# EasyEDA Pro project Flight_Control_V3.eprj

# Schematic Schematic1
Board Name: Board1; Create Date: 2026-01-02; Page Name: P1; Project Name: Flight_Control_V2; Schematic Name: Schematic1; Update Date: 2026-01-20; Company: 嘉立创EDA; Page Size: A4; Version: V1.0
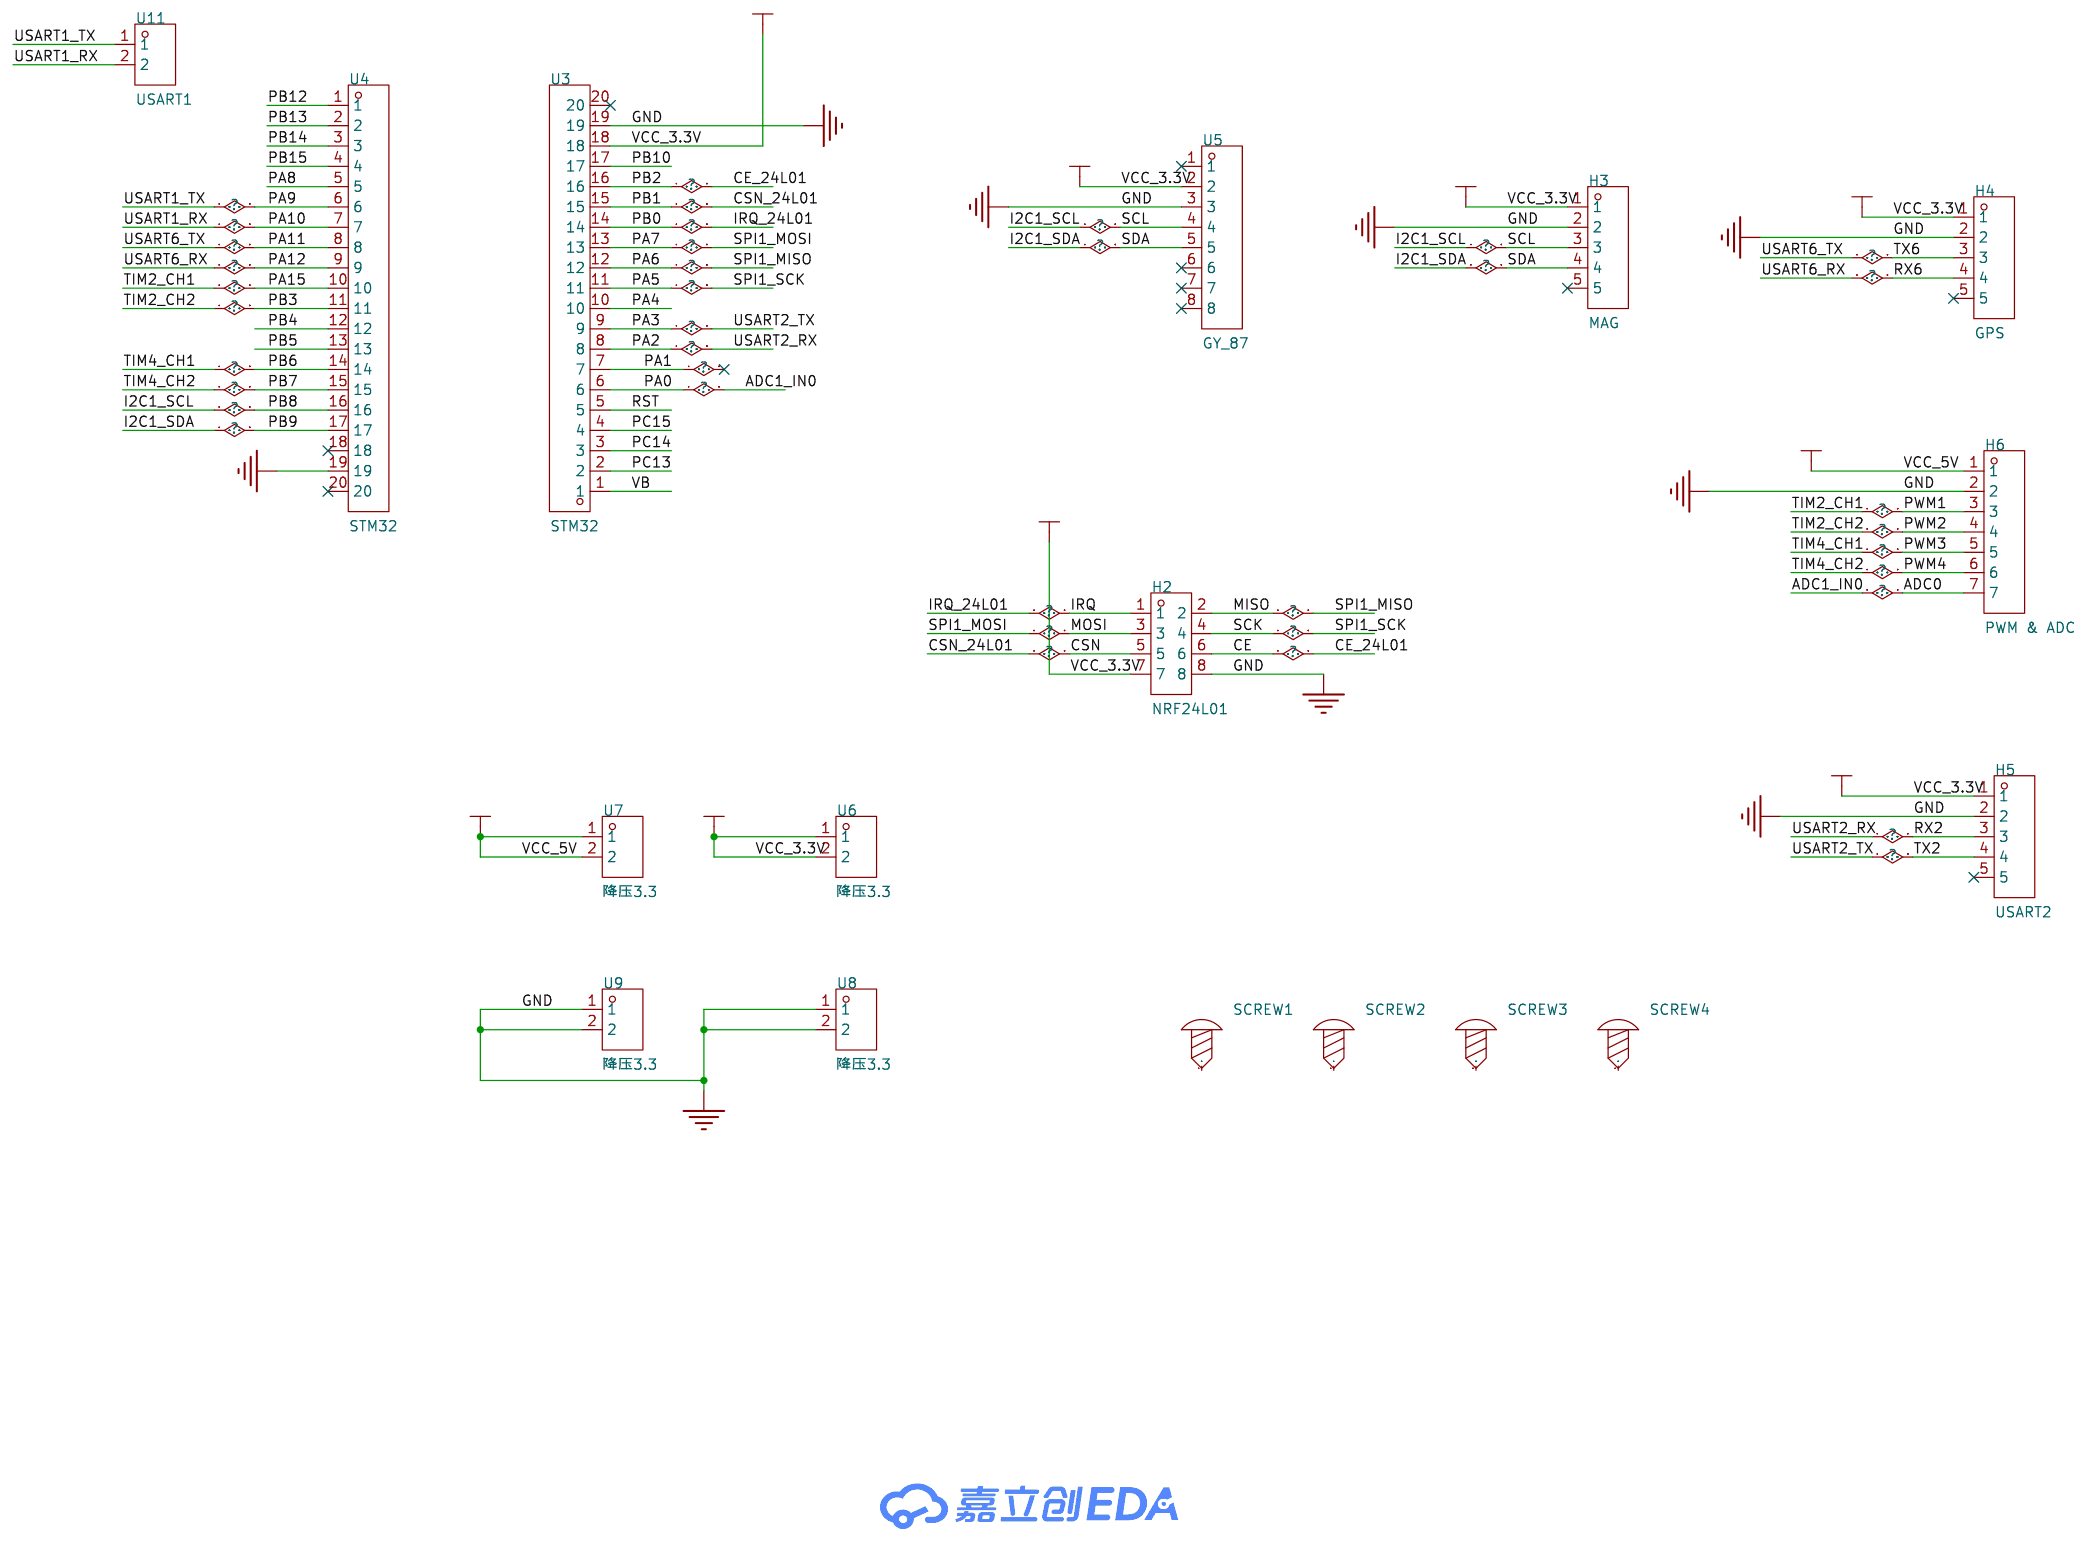
[diagram p0: schematic sheet]

## Parts
H2  NRF24L01  [HDR-TH_8P-P2.54-V-F-R2-C4-S2.54]
H3  MAG  [HDR-TH_5P-P2.54-V-F]
H4  GPS  [HDR-TH_5P-P2.54-V-F]
H5  USART2  [HDR-TH_5P-P2.54-V-F]
H6  PWM & ADC  [HDR-TH_7P-P2.54-V-F]
SCREW1  -  [M3螺丝]
SCREW2  -  [M3螺丝]
SCREW3  -  [M3螺丝]
SCREW4  -  [M3螺丝]
U3  STM32  [HDR-TH_20P-P2.54-V-F]
U4  STM32  [HDR-TH_20P-P2.54-V-F]
U5  GY_87  [HDR-TH_8P-P2.54-V-F]
U6  降压3.3  [HDR-TH_2P-P2.54-V-F]
U7  降压3.3  [HDR-TH_2P-P2.54-V-F]
U8  降压3.3  [HDR-TH_2P-P2.54-V-F]
U9  降压3.3  [HDR-TH_2P-P2.54-V-F]
U11  USART1  [HDR-TH_2P-P2.54-V-F]

## Library data of the parts
H2 = PM254V-12-08-H85: LCSC Part Name: 间距:2.54mm 2x4P 直插; Supplier Part: C2834799; Manufacturer: XFCN(兴飞); Supplier Footprint: 插件,P=2.54mm; JLCPCB Part Class: 扩展库; Datasheet: https://item.szlcsc.com/datasheet/PM254V-12-08-H85/2997439.html; Supplier: LCSC; Holes Structure: 2x4P; Pitch: 2.54mm; Row Spacing: 2.54mm; Circular Hole / Square Hole: 方孔; Mounting Type: 直插; Number of Rows: 双排; Number of Positions: 8P; Current Rating: 3A; Voltage Rating (Max): 250V; Holes Direction: 顶部; Insulation Height: 8.5mm; Operating Temperature: -40℃~+105℃
H3-H5 = PM254V-11-05-H85: LCSC Part Name: 1x5P 间距:2.54mm 直插; Supplier Part: C541852; Manufacturer: XFCN(兴飞); Supplier Footprint: 插件,P=2.54mm; JLCPCB Part Class: 扩展库; Datasheet: https://item.szlcsc.com/datasheet/PM254V-11-05-H85/562473.html; Supplier: LCSC; Holes Structure: 1x5P; Pitch: 2.54mm; Circular Hole / Square Hole: 方孔; Mounting Type: 直插; Number of Rows: 单排; Number of Positions: 5P; Current Rating: 3A; Holes Direction: 顶部; Insulation Height: 8.5mm; Contact Material: 黄铜; Operating Temperature: -40℃~+105℃
H6 = PM254V-11-07-H85: LCSC Part Name: 间距:2.54mm 1x7P 直插; Supplier Part: C2832270; Manufacturer: XFCN(兴飞); Supplier Footprint: 插件,P=2.54mm; JLCPCB Part Class: 扩展库; Datasheet: https://item.szlcsc.com/datasheet/PM254V-11-07-H85/2989788.html; Supplier: LCSC; Holes Structure: 1x7P; Pitch: 2.54mm; Circular Hole / Square Hole: 方孔; Mounting Type: 直插; Number of Rows: 单排; Number of Positions: 7P; Current Rating: 3A; Voltage Rating (Max): 250V; Holes Direction: 顶部; Operating Temperature: -40℃~+105℃
SCREW1-SCREW4 = M3螺丝: Supplier Footprint: 插件
U3 U4 = ZX-PM2.54-1-20PY: LCSC Part Name: 1x20P 间距:2.54mm 直插; Supplier Part: C7499336; Manufacturer: Megastar(兆星); Supplier Footprint: 插件,P=2.54mm; JLCPCB Part Class: 扩展库; Datasheet: https://item.szlcsc.com/datasheet/ZX-PM2.54-1-20PY/8573997.html; Supplier: LCSC; Holes Structure: 1x20P; Pitch: 2.54mm; Circular Hole / Square Hole: 方孔; Mounting Type: 直插; Number of Rows: 单排; Number of Positions: 20P; Current Rating: 3A; Holes Direction: 顶部; Insulation Height: 8.5mm; Contact Material: 黄铜; Contact Plating: 金; Operating Temperature: -40℃~+105℃; PIN Length: 3.2mm
U5 = PM254-1-08-Z-8.5: LCSC Part Name: 1x8P 间距:2.54mm 直插; Supplier Part: C2897371; Manufacturer: HCTL(华灿天禄); Supplier Footprint: 插件,P=2.54mm; JLCPCB Part Class: 扩展库; Datasheet: https://item.szlcsc.com/datasheet/PM254-1-08-Z-8.5/3142376.html; Supplier: LCSC; Holes Structure: 1x8P; Pitch: 2.54mm; Circular Hole / Square Hole: 方孔; Mounting Type: 直插; Number of Rows: 单排; Number of Positions: 8P; Current Rating: 3A; Holes Direction: 顶部; Insulation Height: 8.5mm; Contact Material: 铜合金; Operating Temperature: -40℃~+105℃
U6-U9 U11 = ZX-PM2.54-1-2PY: LCSC Part Name: 1x2P 间距:2.54mm 直插; Supplier Part: C7499322; Manufacturer: Megastar(兆星); Supplier Footprint: 插件,P=2.54mm; JLCPCB Part Class: 扩展库; Datasheet: https://item.szlcsc.com/datasheet/ZX-PM2.54-1-2PY/8573983.html; Supplier: LCSC; Holes Structure: 1x2P; Pitch: 2.54mm; Circular Hole / Square Hole: 方孔; Mounting Type: 直插; Number of Rows: 单排; Number of Positions: 2P; Current Rating: 3A; Holes Direction: 顶部; Insulation Height: 8.5mm; Contact Material: 黄铜; Contact Plating: 金; Operating Temperature: -40℃~+105℃; PIN Length: 3.2mm

## Nets
GND: H2.8 H3.2 H4.2 H5.2 H6.2 U3.19 U4.19 U5.3 U8.1 U8.2 U9.1 U9.2
VCC_3.3V: H2.7 H3.1 H4.1 H5.1 U3.18 U5.2 U6.1 U6.2
VCC_5V: H6.1 U7.1 U7.2
ADC0: H6.7 U3.6
CE: H2.6 U3.16
CSN: H2.5 U3.15
I2C1_SCL: H3.3 U4.16 U5.4
I2C1_SDA: H3.4 U4.17 U5.5
IRQ: H2.1 U3.14
MISO: H2.2 U3.12
MOSI: H2.3 U3.13
PA1: U3.7
PA2: H5.3 U3.8
PA3: H5.4 U3.9
PA4: U3.10
PA5: H2.4 U3.11
PA8: U4.5
PA9: U4.6 U11.1
PA10: U4.7 U11.2
PA11: H4.3 U4.8
PA12: H4.4 U4.9
PA15: H6.3 U4.10
PB3: H6.4 U4.11
PB4: U4.12
PB5: U4.13
PB6: H6.5 U4.14
PB7: H6.6 U4.15
PB10: U3.17
PB12: U4.1
PB13: U4.2
PB14: U4.3
PB15: U4.4
PC13: U3.2
PC14: U3.3
PC15: U3.4
RST: U3.5
VB: U3.1

Not connected (* = marked no-connect by the designer): H3 5*; H4 5*; H5 5*; SCREW1 1; SCREW2 1; SCREW3 1; SCREW4 1; U3 20*; U4 18* 20*; U5 1* 6* 7* 8*

# Board PCB1
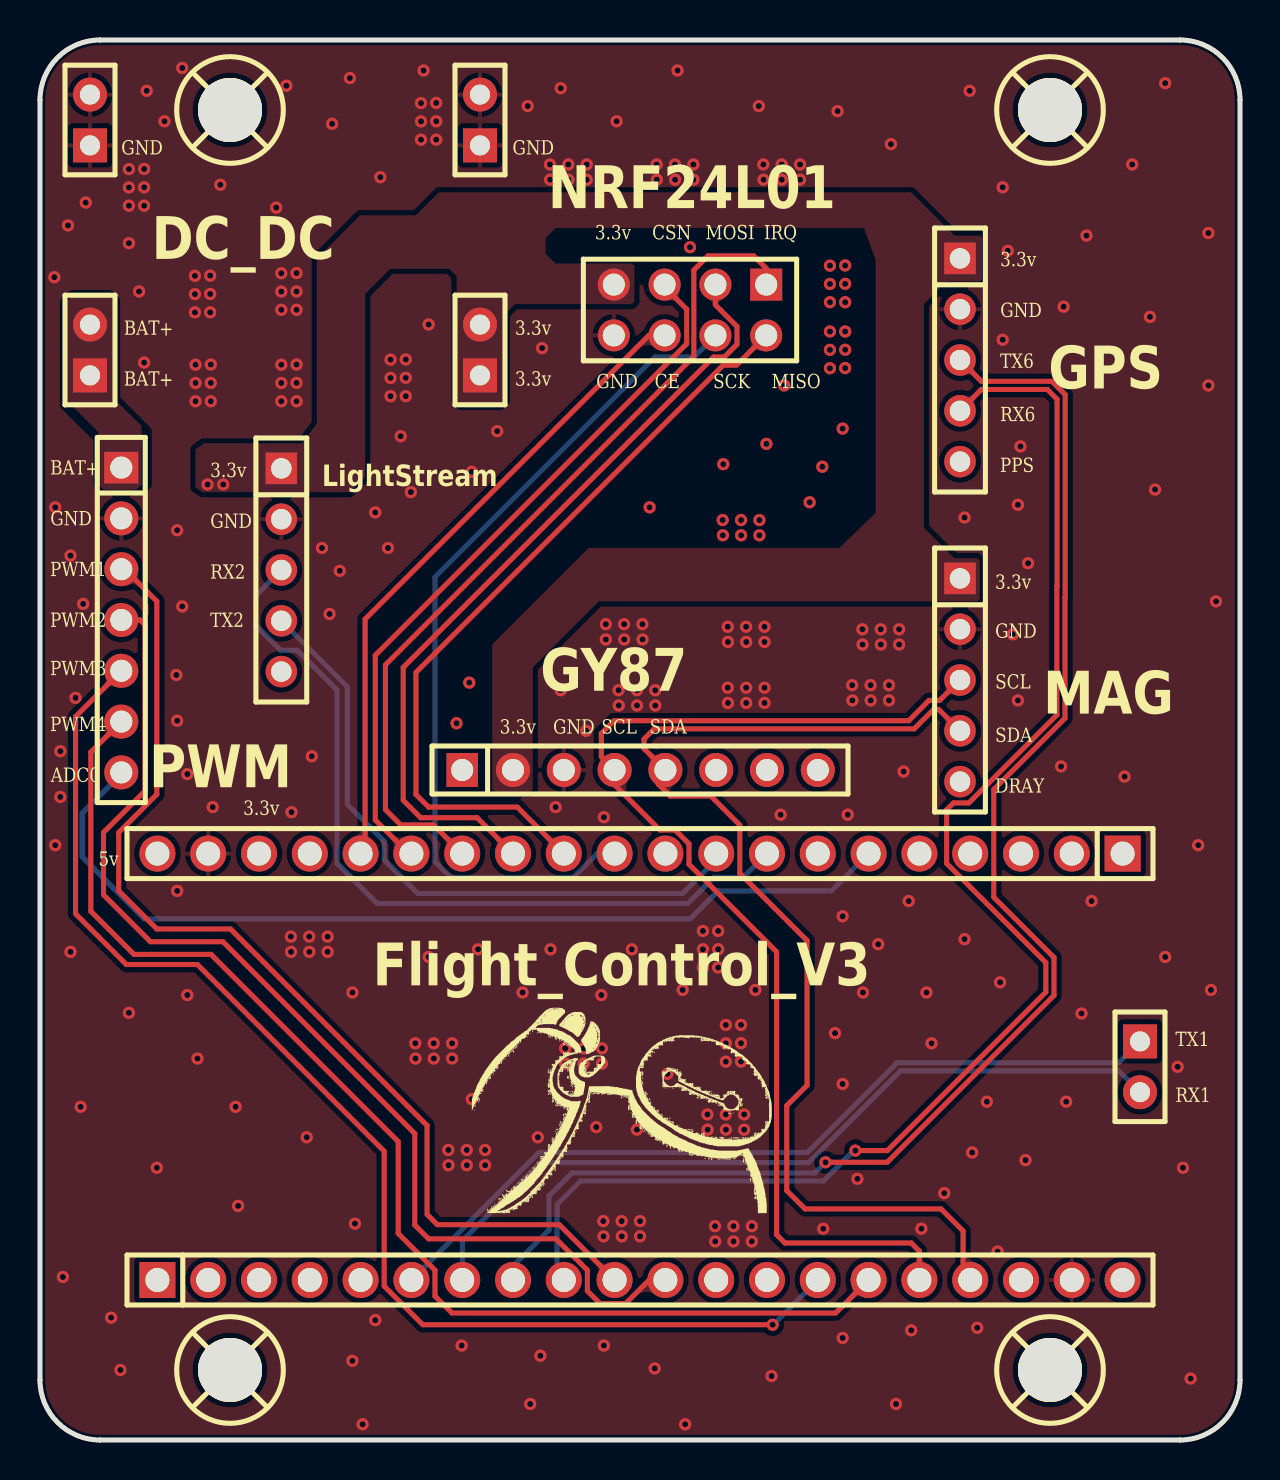
[diagram p1: board, top side]
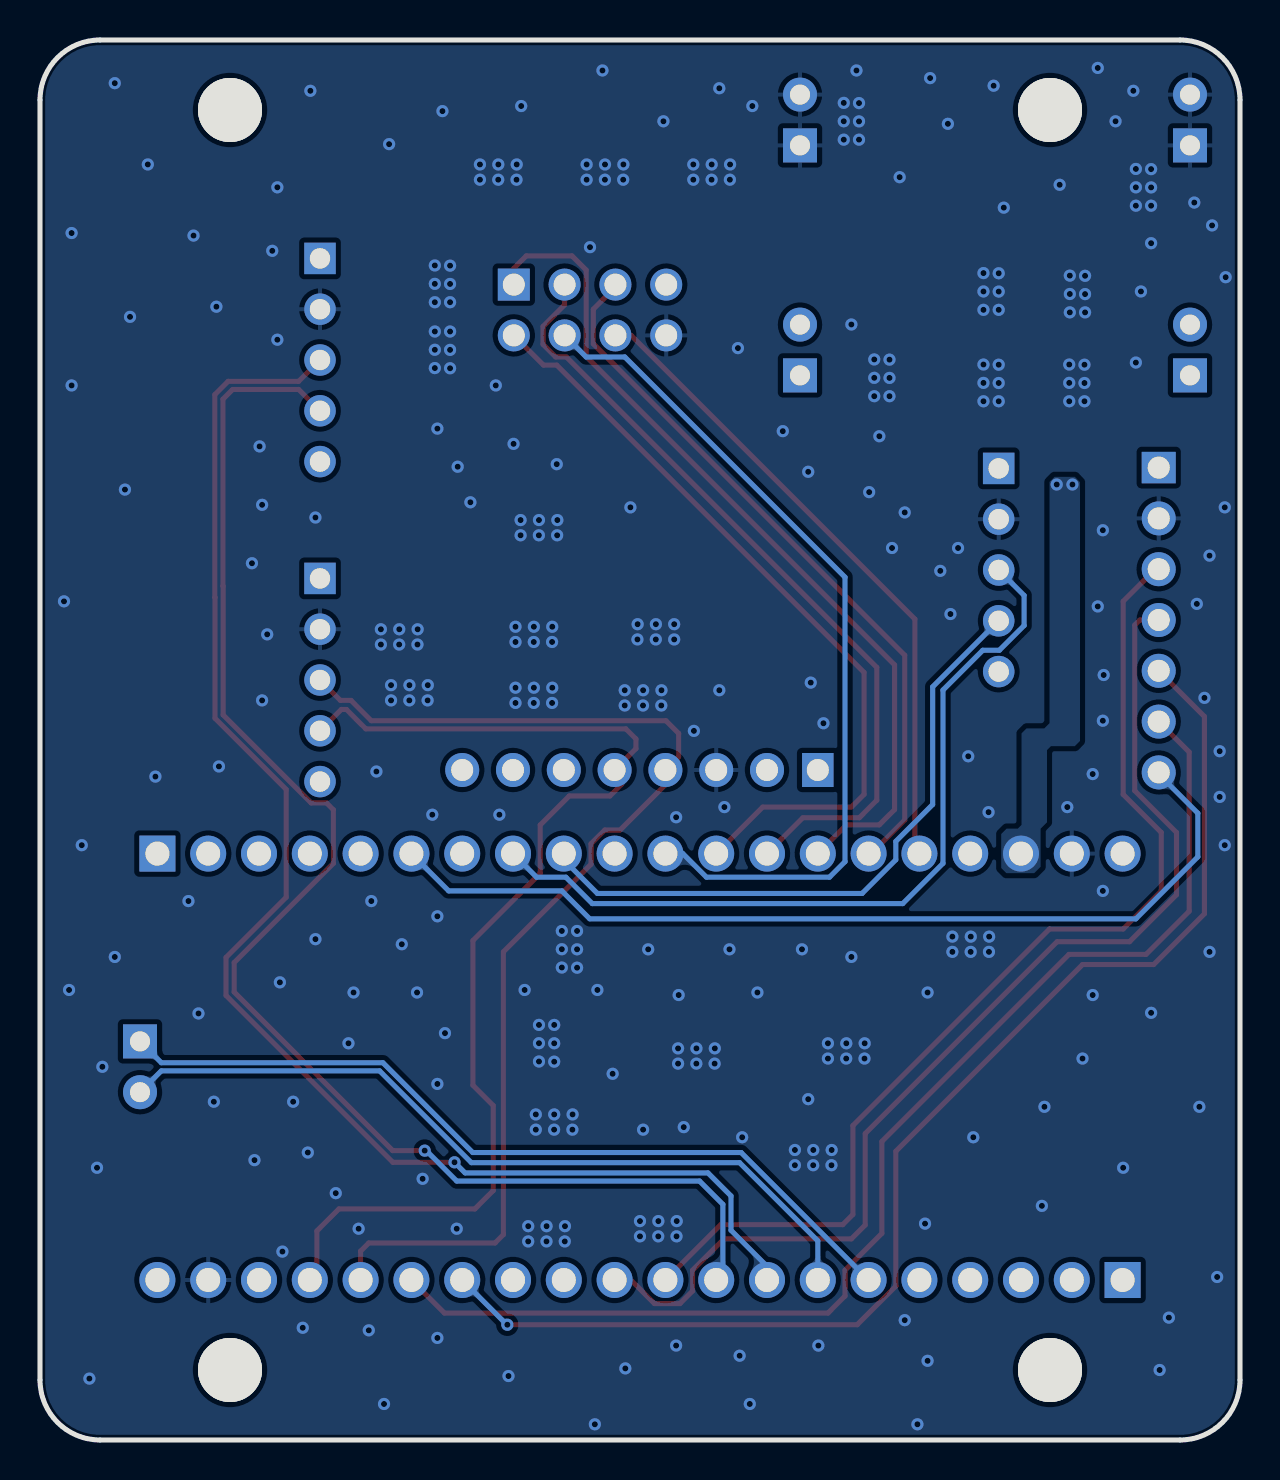
[diagram p2: board, bottom side, seen from below]

Outline 60 x 70 mm; copper layers: Top Layer, Bottom Layer. Coordinates in mm from the lower left corner of the outline.
Outline path: 0,67 0,3 arc(0.88,0.88) 3,0 57,0 arc(59.12,0.88) 60,3 60,67 arc(59.12,69.12) 57,70 3,70 arc(0.88,69.12) 0,67
Stack: Top Layer 0.035mm / Dielectric1 1.51mm FR4 er 4.5 / Bottom Layer 0.035mm

## Design rules (mm)
net PB7: DP1
net PB6: DP1
net PB3: DP2
net PA15: DP2
net PA12: DP4
net PA11: DP4
net PA10: DP5
net PA9: DP5
net MISO: DP6
net MOSI: DP6
net I2C1_SDA: DP3
net I2C1_SCL: DP3
template: JLCPCB Capability(Two Layers Board)
spacing copperThickness1oz (default): track to track 0.102, other pairs 0.152 to 0.3
spacing copperThickness2oz: track to track 0.203, other pairs 0.152 to 0.3
track width copperThickness1oz (default): min 0.127, default 0.254, max 2.54
track width copperThickness2oz: min 0.203, default 0.254, max 2.54
differential pair differentialPair (default): width min 0.127, default 0.254, max 2.54; gap min 0.152, default 0.152
via viaSize (default): diameter min 0.5, default 0.61, max 10; hole min 0.3, default 0.305, max 6.3

## Placement (name value [footprint] x y rotation side)
H2  NRF24L01  [HDR-TH_8P-P2.54-V-F-R2-C4-S2.54]  32.5 56.5 180 top
H3  MAG  [HDR-TH_5P-P2.54-V-F]  46 38 270 top
H4  GPS  [HDR-TH_5P-P2.54-V-F]  46 54 270 top
H5  USART2  [HDR-TH_5P-P2.54-V-F]  12.06 43.5 270 top
H6  PWM & ADC  [HDR-TH_7P-P2.54-V-F]  4.06 41 270 top
SCREW1  -  [M3螺丝]  9.5 66.5 0 top
SCREW2  -  [M3螺丝]  50.5 66.5 0 top
SCREW3  -  [M3螺丝]  9.5 3.5 0 top
SCREW4  -  [M3螺丝]  50.5 3.5 0 top
U3  STM32  [HDR-TH_20P-P2.54-V-F]  30 29.32 180 top
U4  STM32  [HDR-TH_20P-P2.54-V-F]  30 8 0 top
U5  GY_87  [HDR-TH_8P-P2.54-V-F]  30 33.5 0 top
U6  降压3.3  [HDR-TH_2P-P2.54-V-F]  22 66 90 top
U7  降压3.3  [HDR-TH_2P-P2.54-V-F]  2.5 66 90 top
U8  降压3.3  [HDR-TH_2P-P2.54-V-F]  22 54.5 90 top
U9  降压3.3  [HDR-TH_2P-P2.54-V-F]  2.5 54.5 90 top
U11  USART1  [HDR-TH_2P-P2.54-V-F]  55 18.66 270 top

## Footprints (pads in the part's own frame, mm; a bottom-side part is the same pattern mirrored in y, then rotated)
HDR-TH_2P-P2.54-V-F
  rect 1.7x1.7 hole 1: 1(-1.27,0)
  round 1.7 hole 1: 2(1.27,0)
HDR-TH_5P-P2.54-V-F
  rect 1.575x1.575 hole 1.02: 1(-5.08,0)
  round 1.575 hole 1.02: 2(-2.54,0) 3(0,0) 4(2.54,0) 5(5.08,0)
HDR-TH_7P-P2.54-V-F
  rect 1.575x1.7 hole 1.1: 1(-7.62,0)
  round 1.7 hole 1.1: 2(-5.08,0) 3(-2.54,0) 4(0,0) 5(2.54,0) 6(5.08,0) 7(7.62,0)
HDR-TH_8P-P2.54-V-F
  rect 1.575x1.7 hole 1.1: 1(-8.89,0)
  round 1.7 hole 1.1: 2(-6.35,0) 3(-3.81,0) 4(-1.27,0) 5(1.27,0) 6(3.81,0) 7(6.35,0) 8(8.89,0)
HDR-TH_8P-P2.54-V-F-R2-C4-S2.54
  rect 1.6x1.6 hole 1.1: 1(-3.81,-1.27)
  round 1.6 hole 1.1: 2(-3.81,1.27) 3(-1.27,-1.27) 4(-1.27,1.27) 5(1.27,-1.27) 6(1.27,1.27) 7(3.81,-1.27) 8(3.81,1.27)
HDR-TH_20P-P2.54-V-F
  rect 1.8x1.8 hole 1.2: 1(-24.13,0)
  round 1.8 hole 1.2: 2(-21.59,0) 3(-19.05,0) 4(-16.51,0) 5(-13.97,0) 6(-11.43,0) 7(-8.89,0) 8(-6.35,0) 9(-3.81,0) 10(-1.27,0) 11(1.27,0) 12(3.81,0) 13(6.35,0) 14(8.89,0) 15(11.43,0) 16(13.97,0) 17(16.51,0) 18(19.05,0) 19(21.59,0) 20(24.13,0)
M3螺丝
  round 3.2 hole 3.2: 1(0,0)

## Nets
As in the schematic, except:
GND: H2.8 H3.2 H4.2 H5.2 H6.2 U3.19 U4.19 U5.3 U6.1 U6.2 U7.1 U7.2
VCC_3.3V: H2.7 H3.1 H4.1 H5.1 U3.18 U5.2 U8.1 U8.2
VCC_5V: H6.1 U9.1 U9.2

Pads without a net: H3 5; H4 5; H5 5; SCREW1 1; SCREW2 1; SCREW3 1; SCREW4 1; U3 20; U4 18 20; U5 1 6 7 8

## Via types
v1: diameter 0.61, hole 0.305, Top Layer to Bottom Layer, 329 vias

## Routing (per net, layer and track width the routed paths; a pad name or vN(x,y) marks a point on that pad's centre or on a via; arc(x,y) is an arc through that point)
GND:
  vias: v1(0.72,58.14) v1(0.76,46.63) v1(0.76,29.74) v1(1.02,34.44) v1(1.02,32.15) v1(1.14,8.15) v1(1.4,60.73) v1(1.52,44.22) v1(1.52,24.41) v1(1.78,37.11) v1(2.03,16.66) v1(2.16,41.81) v1(2.29,61.87) v1(3.56,6.12) v1(4.02,3.5) v1(4.44,63.54) v1(4.44,62.63) v1(4.44,61.72) v1(4.44,59.84) v1(4.44,21.36) v1(4.95,57.43) v1(5.21,63.55) v1(5.21,62.63) v1(5.21,61.72) v1(5.21,53.87) v1(5.33,67.46) v1(5.84,13.61) v1(6.22,65.94) v1(6.82,38.25) v1(6.86,45.49) v1(6.86,35.96) v1(6.86,27.45) v1(7.11,68.6) v1(7.11,41.68) v1(7.37,33.3) v1(7.37,22.25) v1(7.75,58.21) v1(7.75,57.3) v1(7.75,56.38) v1(7.78,53.76) v1(7.78,52.85) v1(7.78,51.94) v1(7.87,19.07) v1(8.51,58.22) v1(8.51,57.3) v1(8.51,56.38) v1(8.54,53.77) v1(8.54,52.86) v1(8.54,51.94) v1(8.64,31.65) v1(9.02,62.76) v1(9.78,16.66) v1(9.91,11.71) v1(11.81,61.62) v1(12.06,58.34) v1(12.06,57.42) v1(12.06,56.51) v1(12.06,53.76) v1(12.06,52.85) v1(12.06,51.94) v1(12.32,67.71) v1(12.54,25.17) v1(12.57,31.39) v1(12.55,24.41) v1(12.83,58.35) v1(12.83,57.43) v1(12.83,56.51) v1(12.83,53.77) v1(12.83,52.86) v1(12.83,51.94) v1(13.34,15.14) v1(13.46,25.17) v1(13.47,24.41) v1(13.59,34.19) v1(14.1,44.6) v1(14.38,25.17) v1(14.38,24.41) v1(14.48,41.3) v1(14.6,65.81) v1(14.99,43.46) v1(15.49,68.09) v1(15.62,22.38) v1(15.62,3.96) v1(15.75,10.82) v1(16.13,0.78) v1(16.76,46.38) v1(16.76,5.99) v1(17.02,63.14) v1(17.4,44.6) v1(17.53,54.02) v1(17.53,53.1) v1(17.53,52.19) v1(18.03,50.19) v1(18.29,54.03) v1(18.29,53.11) v1(18.29,52.19) v1(18.54,47.39) v1(18.77,19.83) v1(18.78,19.07) v1(19.05,66.85) v1(19.05,65.93) v1(19.05,65.02) v1(19.18,68.48) v1(19.43,55.78) v1(19.43,24.15) v1(19.69,19.83) v1(19.69,19.07) v1(19.81,66.86) v1(19.81,65.94) v1(19.81,65.02) v1(20.42,14.5) v1(20.43,13.74) v1(20.6,19.83) v1(20.6,19.07) v1(20.83,35.84) v1(21.08,4.72) v1(21.34,14.5) v1(21.34,13.74) v1(21.46,37.87) v1(21.59,48.41) v1(21.59,17.04) v1(21.9,24.53) v1(22.25,14.5) v1(22.25,13.74) v1(22.86,50.44) v1(24.13,22.38) v1(24.38,66.7) v1(24.51,1.8) v1(24.89,15.14) v1(25.02,4.21) v1(25.1,54.59) v1(25.5,63.78) v1(25.51,63.02) v1(25.53,24.53) v1(25.78,31.65) v1(26.03,67.59) v1(26.03,37.49) v1(26.26,19.58) v1(26.27,18.82) v1(26.42,63.78) v1(26.42,63.02) v1(27.18,19.58) v1(27.18,18.82) v1(27.34,63.78) v1(27.34,63.02) v1(27.31,35.46) v1(27.81,15.64) v1(28.07,22.25) v1(28.1,19.58) v1(28.1,18.82) v1(28.19,31.14) v1(28.16,10.94) v1(28.17,10.18) v1(28.19,4.72) v1(28.29,40.79) v1(28.29,40.03) v1(28.83,65.94) v1(28.93,37.49) v1(28.94,36.73) v1(29.08,10.94) v1(29.09,10.18) v1(29.21,40.79) v1(29.21,40.03) v1(29.59,24.53) v1(29.84,37.49) v1(29.85,36.73) v1(29.84,15.52) v1(30,10.94) v1(30,10.18) v1(30.12,40.79) v1(30.13,40.03) v1(30.48,46.63) v1(30.73,3.58) v1(30.83,63.78) v1(30.84,63.02) v1(30.76,37.49) v1(30.76,36.73) v1(31.37,18.31) v1(31.75,63.78) v1(31.75,63.02) v1(31.88,68.48) v1(32.13,22.5) v1(32.26,0.78) v1(32.5,59.64) v1(32.67,63.78) v1(32.67,63.02) v1(33.15,25.45) v1(33.15,24.53) v1(33.15,23.61) v1(33.37,16.28) v1(33.38,15.52) v1(33.75,10.69) v1(33.76,9.93) v1(33.91,25.45) v1(33.91,24.54) v1(33.91,23.62) v1(34.13,46) v1(34.14,45.23) v1(34.16,48.79) v1(34.29,20.75) v1(34.29,19.83) v1(34.29,18.92) v1(34.29,16.28) v1(34.29,15.52) v1(34.39,40.66) v1(34.4,39.9) v1(34.39,37.61) v1(34.4,36.85) v1(34.67,10.69) v1(34.68,9.93) v1(35.05,46) v1(35.06,45.23) v1(35.05,20.75) v1(35.05,19.84) v1(35.05,18.93) v1(35.21,16.28) v1(35.21,15.52) v1(35.31,40.66) v1(35.31,39.9) v1(35.31,37.61) v1(35.31,36.85) v1(35.59,10.69) v1(35.59,9.93) v1(35.77,22.5) v1(35.94,66.7) v1(35.97,46) v1(35.97,45.23) v1(36.16,63.78) v1(36.17,63.02) v1(36.22,40.66) v1(36.22,39.9) v1(36.22,37.61) v1(36.22,36.85) v1(36.32,49.81) v1(36.58,3.2) v1(37.03,31.27) v1(37.08,63.78) v1(37.09,63.02) v1(37.21,52.73) v1(38,63.78) v1(38,63.02) v1(38.48,46.89) v1(39.12,48.66) v1(39.16,10.56) v1(39.5,58.72) v1(39.5,57.8) v1(39.5,56.89) v1(39.5,55.42) v1(39.5,54.51) v1(39.5,53.59) v1(39.75,20.34) v1(39.88,66.44) v1(40.13,50.57) v1(40.13,26.19) v1(40.13,17.8) v1(40.13,5.1) v1(40.26,58.73) v1(40.26,57.81) v1(40.26,56.89) v1(40.26,55.42) v1(40.26,54.51) v1(40.26,53.6) v1(40.39,31.27) v1(40.61,37.74) v1(40.62,36.98) v1(40.87,13.06) v1(41.12,40.54) v1(41.13,39.77) v1(41.15,22.38) v1(41.53,37.74) v1(41.53,36.98) v1(41.91,24.79) v1(42.04,40.54) v1(42.04,39.77) v1(42.45,37.74) v1(42.45,36.98) v1(42.54,64.79) v1(42.8,1.8) v1(42.96,40.54) v1(42.96,39.77) v1(43.18,33.42) v1(43.43,26.95) v1(43.56,5.48) v1(44.07,10.56) v1(44.32,22.38) v1(44.58,19.83) v1(45.21,12.34) v1(46.23,46.12) v1(46.23,25.04) v1(46.48,67.46) v1(46.61,14.37) v1(46.86,5.61) v1(47.34,16.91) v1(47.88,9.42) v1(48.01,22.88) v1(48.13,62.63) v1(48.13,55.01) v1(48.39,59.46) v1(48.64,40.28) v1(48.9,46.76) v1(48.9,36.98) v1(49.02,49.68) v1(49.28,13.99) v1(49.4,43.84) v1(51.05,33.68) v1(51.18,56.67) v1(51.31,16.91) v1(52.08,21.33) v1(52.32,60.22) v1(52.58,26.95) v1(54.23,33.17) v1(54.61,63.78) v1(55.5,56.16) v1(55.75,47.52) v1(56.26,67.84) v1(56.26,24.15) v1(56.88,18.66) v1(57.15,13.61) v1(57.53,3.07) v1(57.91,29.74) v1(58.42,60.35) v1(58.42,52.73) v1(58.55,22.5) v1(58.8,41.93)
VCC_3.3V:
  vias: v1(8.38,47.78) v1(9.16,47.78)
ADC0: length 47
  Bottom Layer w0.254: H6.7 4.06,33.3 2.11,31.34 2.11,29.16 5.21,26.06 32.51,26.06 33.91,27.45 39.56,27.45 U3.6
CE: length 32.7
  Top Layer w0.254: H2.6 30.44,55.23 16.26,41.04 16.26,29.55 U3.16
CSN: length 36.2
  Top Layer w0.254: U3.15 18.44,29.32 16.76,31 16.76,39.24 32.34,54.81 32.34,56.54 31.23,57.64 H2.5
I2C1_SCL: length 57.1
  Top Layer w0.254: H3.3 44.98,36.98 44.45,36.98 43.43,35.96 28.7,35.96 28.07,35.33 28.07,34.16 U5.4 28.73,32.76 30.99,30.5 31.76,30.5 32.45,29.81 32.45,28.79 36.83,24.41 36.83,10.27 37.25,9.85 43.56,9.85 43.97,9.44 U4.16
I2C1_SDA: length 57
  Top Layer w0.254: U4.17 46.16,8.35 46.16,10.45 45.05,11.55 38.25,11.55 37.34,12.47 37.34,16.72 38.35,17.74 38.35,24.97 34.99,28.34 34.99,30.75 33.54,32.2 31.5,32.2 30.92,32.79 30.92,33.15 U5.5 30.2,34.57 30.2,35.05 30.71,35.56 43.71,35.56 44.68,36.53 44.93,36.53 H3.4
IRQ: length 43.1
  Top Layer w0.254: U3.14 19.67,30.76 18.03,30.76 17.27,31.52 17.27,38.76 32.69,54.18 32.69,58.5 33.4,59.2 35.69,59.2 36.31,58.58 H2.1
MISO: length 39.2
  Top Layer w0.254: U3.12 23.86,31.65 19.43,31.65 18.8,32.28 18.8,38.38 34.16,53.74 34.82,53.74 H2.2
MOSI: length 40.1
  Top Layer w0.254: H2.3 33.77,56.76 34.85,55.68 34.85,54.78 34.22,54.15 33.68,54.15 18.16,38.63 18.16,31.99 19.03,31.11 21.86,31.11 U3.13
PA2: length 40.7
  Bottom Layer w0.254: H5.3 10.79,42.23 10.79,40.72 12.03,39.49 12.86,39.49 14.85,37.5 14.85,28.83 16.86,26.82 32.38,26.82 33.71,28.14 35.17,28.14 U3.8
PA3: length 32.4
  Bottom Layer w0.254: U3.9 33.81,29.01 32.13,27.33 18.89,27.33 17.21,29.01 17.21,29.93 15.37,31.77 15.37,37.66 H5.4
PA5: length 43
  Bottom Layer w0.254: H2.4 32.69,54.15 30.76,54.15 19.75,43.14 19.75,28.92 20.52,28.14 26.68,28.14 27.86,29.32 U3.11
PA9: length 41.4
  Bottom Layer w0.254: U11.1 53.93,18.86 42.85,18.86 38.36,14.37 24.94,14.37 U4.6
PA10: length 39.8
  Bottom Layer w0.254: U11.2 53.93,18.46 43.02,18.46 38.43,13.87 25.02,13.87 21.11,9.96 U4.7
PA11: length 73.1
  Top Layer w0.254: H4.3 47.07,52.93 50.59,52.93 51.26,52.27 51.26,42.14 51.25,42.13 51.25,36.09 47.69,32.53 47.69,27.14 50.7,24.13 50.7,22.23 42.35,13.89 v1(39.27,13.89)
  Bottom Layer w0.254: U4.8 23.65,8.69 25.45,10.49 25.45,12.2 26.6,13.35 38.74,13.35 v1(39.27,13.89)
PA12: length 72.7
  Top Layer w0.254: H4.4 47.07,52.53 50.37,52.53 50.85,52.04 50.85,42.69 50.84,42.69 50.84,36.25 46.44,31.85 45.67,31.85 45.33,31.51 45.33,28.83 50.29,23.87 50.29,22.4 42.36,14.47 v1(40.77,14.47)
  Bottom Layer w0.254: v1(40.77,14.47) 40.68,14.47 39.16,12.95 27.02,12.95 25.86,11.78 25.86,8.5 26.19,8.17 U4.9
PA15: length 53.2
  Top Layer w0.254: U4.10 25.96,10.77 19.86,10.77 19.35,11.28 19.35,15.72 9.53,25.55 5.84,25.55 3.94,27.45 3.94,30.38 5.84,32.28 5.84,41.93 4.23,43.54 H6.3
PB3: length 56
  Top Layer w0.254: H6.4 5.01,41 5.26,40.75 5.26,32.46 3.17,30.38 3.17,27.26 5.52,24.92 9.14,24.92 18.74,15.32 18.74,10.75 19.43,10.06 25.8,10.06 27.37,8.49 27.37,7.45 28,6.82 29.28,6.82 30.46,8 U4.11
PB6: length 63.6
  Top Layer w0.254: v1(36.63,5.76) 19.14,5.76 17.21,7.69 17.21,14.44 7.87,23.77 4.32,23.77 1.78,26.31 1.78,36.17 H6.5
  Bottom Layer w0.254: v1(36.63,5.76) 36.65,5.76 U4.14
PB7: length 61.5
  Top Layer w0.254: H6.6 2.54,34.4 2.54,26.44 4.7,24.28 8.55,24.28 17.91,14.92 17.91,10.33 19.75,8.49 19.75,7.2 20.6,6.35 39.78,6.35 U4.15

## Copper pours and planes (outline as drawn; the poured copper is in the pictures)
GND on Top Layer: -0.38,71.52 61.47,71.52 61.47,-0.49 -0.38,-0.49
GND on Bottom Layer: -0.89,72.29 62.23,72.29 62.23,-1.75 -0.89,-1.75
VCC_3.3V on Top Layer: 7.77,62.38 47.12,62.38 47.12,32.41 7.77,32.41
VCC_3.3V on Bottom Layer: 8,48.16 11.94,48.16 11.94,28.34 8,28.34
VCC_5V on Top Layer: 1.25,56.89 1.54,57.17 3.46,57.17 3.75,56.89 3.75,52.03 5.33,50.44 5.33,47.78 5.08,47.52 3.17,47.52 2.92,47.78 2.92,50.09 1.25,51.76
VCC_5V on Top Layer: 1.25,57.24 5.08,57.24 5.08,47.52 1.25,47.52

Small or netless copper shapes (teardrops, artwork), in the pictures only: 28 on Top Layer, 16 on Bottom Layer

## Text on the board
Top Silkscreen Layer: LightStream | PWM | DC_DC | Flight_Control_V3 | GY87 | NRF24L01 | MAG | GPS | DRAY | 3.3v | GND | SCL | SDA | PPS | TX6 | RX6 | PWM1 | PWM2 | PWM3 | PWM4 | BAT+ | ADC0 | 5v | RX2 | TX2 | CSN | CE | MOSI | SCK | IRQ | MISO | TX1 | RX1
